# EAGLE design Arduino_DUE_X_V02d-2Layer (EAGLE 7.1.0)
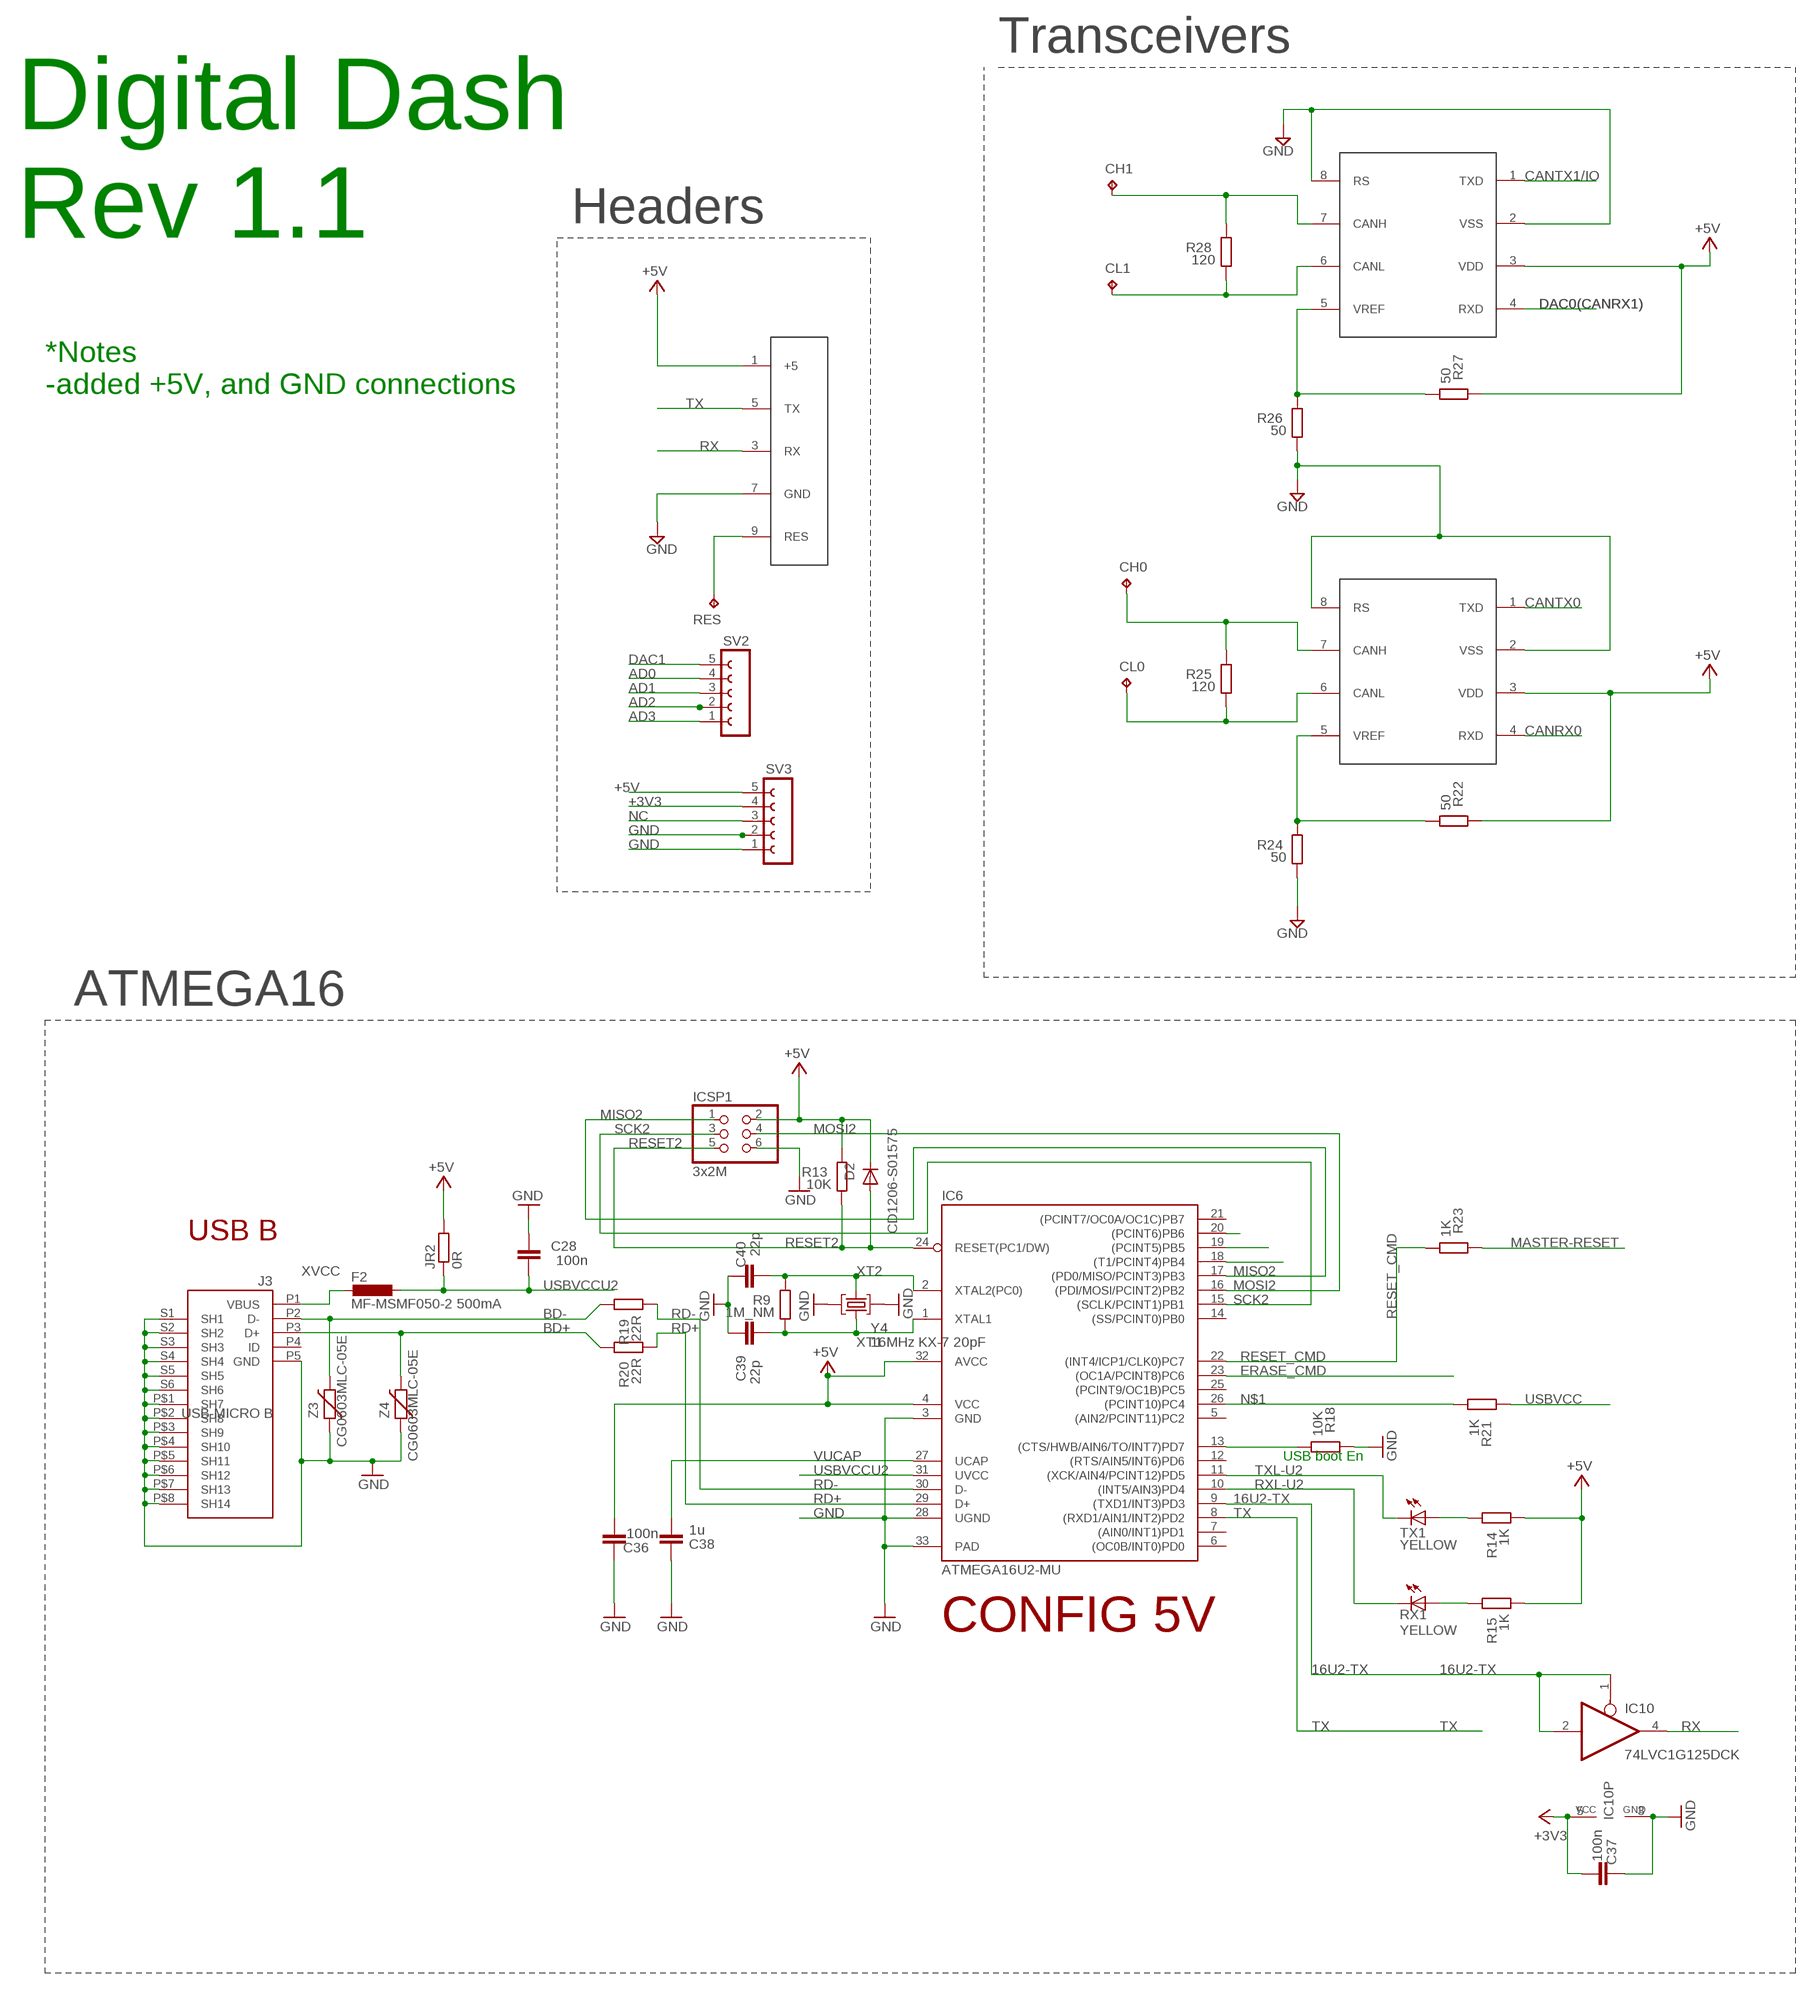
[diagram p0: schematic, sheet 1, part 1 of 2]
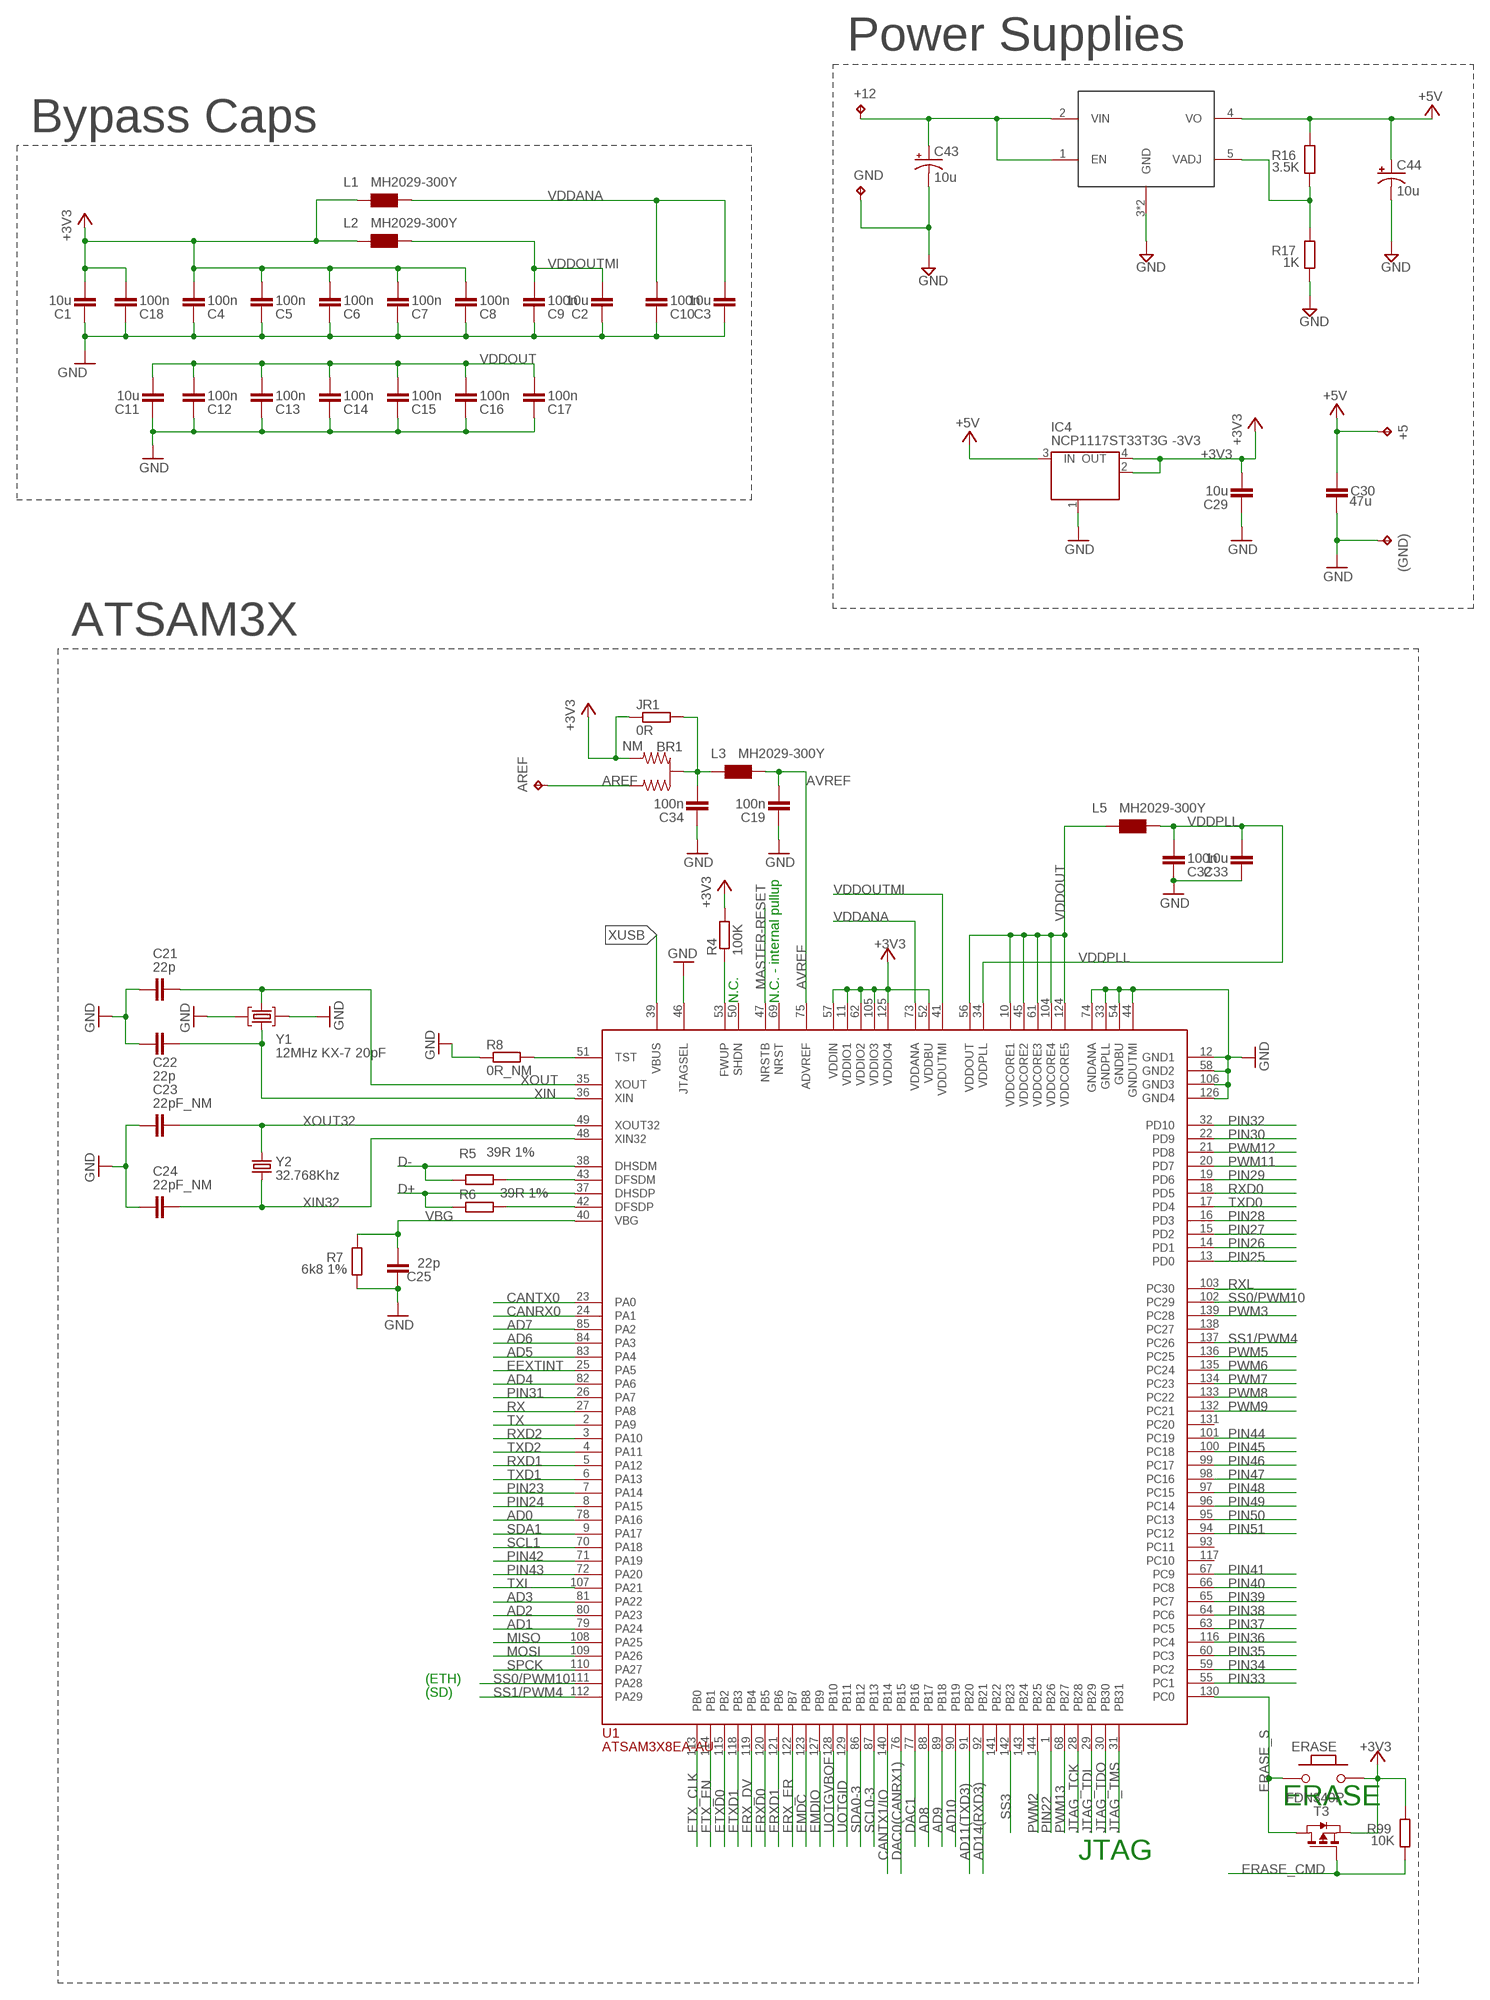
[diagram p1: schematic, sheet 1, part 2 of 2]

## Parts
(GND)  TPPAD1-13  [P1-13]
+5  TPPAD1-13  [P1-13]
+12  TPPAD1-13  [P1-13]
AREF  TPB1,27  [B1,27]
BR1  NM  J0402  [J0402]
C1  10u  C-EUC0805K  [C0805K]
C2  10u  C-EUC0805K  [C0805K]
C3  10u  C-EUC0805K  [C0805K]
C4  100n  C-EUC0805  [C0805]
C5  100n  C-EUC0805  [C0805]
C6  100n  C-EUC0805  [C0805]
C7  100n  C-EUC0805  [C0805]
C8  100n  C-EUC0805  [C0805]
C9  100n  C-EUC0805  [C0805]
C10  100n  C-EUC0805  [C0805]
C11  10u  C-EUC0805K  [C0805K]
C12  100n  C-EUC0805  [C0805]
C13  100n  C-EUC0805  [C0805]
C14  100n  C-EUC0805  [C0805]
C15  100n  C-EUC0805  [C0805]
C16  100n  C-EUC0805  [C0805]
C17  100n  C-EUC0805  [C0805]
C18  100n  C-EUC0805  [C0805]
C19  100n  C-EUC0805  [C0805]
C21  22p  C-EUC0805  [C0805]
C22  22p  C-EUC0805  [C0805]
C23  22pF_NM  C-EUC0805  [C0805]
C24  22pF_NM  C-EUC0805  [C0805]
C25  22p  C-EUC0805  [C0805]
C28  100n  C-EUC0805  [C0805]
C29  10u  C-EUC0805K  [C0805K]
C30  47u  C-EUC0805  [C0805]
C32  100n  C-EUC0805  [C0805]
C33  10u  C-EUC0805K  [C0805K]
C34  100n  C-EUC0805  [C0805]
C36  100n  C-EUC0805  [C0805]
C37  100n  C-EUC0805  [C0805]
C38  1u  C-EUC0805  [C0805]
C39  22p  C-EUC0805  [C0805]
C40  22p  C-EUC0805  [C0805]
C43  10u  CPOL-US153CLV-0405  [153CLV-0405]
C44  10u  CPOL-US153CLV-0405  [153CLV-0405]
CH0  TPPAD1-13  [P1-13]
CH1  TPPAD1-13  [P1-13]
CL0  TPPAD1-13  [P1-13]
CL1  TPPAD1-13  [P1-13]
D2  CD1206-S01575  DIODE-MINIMELF  [MINIMELF]
ERASE  MYSMD_PB157  [SMD_157SW]
F2  MF-MSMF050-2 500mA  L-EUL1812  [L1812]
GND  TPPAD1-13  [P1-13]
IC4  NCP1117ST33T3G -3V3  MC33269ST-3.3T3  [SOT223]
IC6  ATMEGA16U2-MU  [MLF32]
IC10  74LVC1G125DCK  [SC70-5]
ICSP1  3x2M  PINHD-2X3  [2X03]
J3  USB-MICRO B  MYCON2_USB-MINI-B  [CON2_USB_MICRO_B_AT]
JR1  0R  R-EU_R0805  [R0805]
JR2  0R  R-EU_R0805  [R0805]
L1  MH2029-300Y  WE-CBF_0805  [0805]
L2  MH2029-300Y  WE-CBF_0805  [0805]
L3  MH2029-300Y  WE-CBF_0805  [0805]
L5  MH2029-300Y  WE-CBF_0805  [0805]
R4  100K  R-EU_R0805  [R0805]
R5  39R 1%  R-EU_R0805  [R0805]
R6  39R 1%  R-EU_R0805  [R0805]
R7  6k8 1%  R-EU_R0805  [R0805]
R8  0R_NM  R-EU_R0805  [R0805]
R9  1M_NM  R-EU_R0805  [R0805]
R13  10K  R-EU_R0805  [R0805]
R14  1K  R-EU_R0805  [R0805]
R15  1K  R-EU_R0805  [R0805]
R16  3.5K  R-EU_R0805  [R0805]
R17  1K  R-EU_R0805  [R0805]
R18  10K  R-EU_R0805  [R0805]
R19  22R  R-EU_R0805  [R0805]
R20  22R  R-EU_R0805  [R0805]
R21  1K  R-EU_R0805  [R0805]
R22  50  R-EU_R0805  [R0805]
R23  1K  R-EU_R0805  [R0805]
R24  50  R-EU_R0805  [R0805]
R25  120  R-EU_R0805  [R0805]
R26  50  R-EU_R0805  [R0805]
R27  50  R-EU_R0805  [R0805]
R28  120  R-EU_R0805  [R0805]
R99  10K  R-EU_R0805  [R0805]
RES  TPB1,27  [B1,27]
RX1  YELLOW  LEDCHIP-LED0805  [CHIP-LED0805]
SV2  FE05-1  [FE05-1]
SV3  FE05-1  [FE05-1]
T3  FDN340P  PMOSSOT23  [SOT-23]
TX1  YELLOW  LEDCHIP-LED0805  [CHIP-LED0805]
U1  ATSAM3X8EA-AU  ATSAM3X/AAU  [LQFP144]
U2  MCP2551  [SOIC8]
U3  LCD_DISPLAY  [FE05-2]
U4  MCP2551  [SOIC8]
U5  TLF1963TBATMA1  TLF1963  [DPAK]
Y1  12MHz KX-7 20pF  CRYSTAL-3.2-2.5  [CRYSTAL-3.2-2.5]
Y2  32.768Khz  RESONATOR_EPSON_FC_145  [RESONATOR_EPSON_FC_145]
Y4  16MHz KX-7 20pF  CRYSTAL-3.2-2.5  [CRYSTAL-3.2-2.5]
Z3  CG0603MLC-05E  VARISTORCN0603  [CT/CN0603]
Z4  CG0603MLC-05E  VARISTORCN0603  [CT/CN0603]

## Nets
8PB4: IC6.18((T1/PCINT4)PB4)
8PB5: IC6.19((PCINT5)PB5)
8PB6: IC6.20((PCINT6)PB6)
16U2-TX: IC6.9((TXD1/INT3)PD3) IC10.1(OE) IC10.2(I)
+3V3: BR1.3 C1.2 C4.2 C5.2 C6.2 C7.2 C8.2 C18.2 C29.2 C37.1 ERASE.1 IC4.2(OUT) IC4.4(OUT) IC10.5(VCC) JR1.1 L1.1 L2.1 R4.2 R99.2 SV3.4 T3.1(S) U1.11(VDDIO1) U1.52(VDDBU) U1.57(VDDIN) U1.62(VDDIO2) U1.105(VDDIO3) U1.125(VDDIO4)
+5V: +5.TP C30.2 C36.1 C44.+ D2.C IC4.3(IN) IC6.4(VCC) IC6.32(AVCC) ICSP1.2 JR2.2 R13.2 R14.1 R15.1 R16.2 R22.2 R27.2 SV3.5 U2.3(VDD) U3.1(+5) U4.3(VDD) U5.4(VO)
AD0: SV2.4 U1.78(PA16)
AD1: SV2.3 U1.79(PA24)
AD2: SV2.2 U1.80(PA23)
AD3: SV2.1 U1.81(PA22)
AD4: U1.82(PA6)
AD5: U1.83(PA4)
AD6: U1.84(PA3)
AD7: U1.85(PA2)
AD8: U1.88(PB17)
AD9: U1.89(PB18)
AD10: U1.90(PB19)
AD11(TXD3): U1.91(PB20)
AD14(RXD3): U1.92(PB21)
AREF: AREF.TP BR1.1
AVREF: C19.2 L3.2 U1.75(ADVREF)
AVREFL: BR1.2(C) C34.2 JR1.2 L3.1
BD+ [USB]: J3.P3(D+) R20.2 Z4.2
BD- [USB]: J3.P2(D-) R19.2 Z3.2
CANRX0: U1.24(PA1) U4.4(RXD)
CANTX0: U1.23(PA0) U4.1(TXD)
CANTX1/IO: U1.140(PB14) U2.1(TXD)
D+ [USBpair]: R6.1 U1.37(DHSDP)
D- [USBpair]: R5.1 U1.38(DHSDM)
DAC0(CANRX1): U1.76(PB15) U2.4(RXD)
DAC1: SV2.5 U1.77(PB16)
DTR: IC6.13((CTS/HWB/AIN6/TO/INT7)PD7) R18.1
EEXTINT: U1.25(PA5)
EMDC: U1.123(PB8)
EMDIO: U1.127(PB9)
ERASE_CMD: IC6.23((OC1A/PCINT8)PC6) R99.1 T3.2(G)
ERASE_S: ERASE.2 T3.3(D) U1.130(PC0)
ERX_DV: U1.119(PB4)
ERX_ER: U1.122(PB7)
ERXD0: U1.120(PB5)
ERXD1: U1.121(PB6)
ETX_CLK: U1.113(PB0)
ETX_EN: U1.114(PB1)
ETXD0: U1.115(PB2)
ETXD1: U1.118(PB3)
GND: (GND).TP C1.1 C2.1 C3.1 C4.1 C5.1 C6.1 C7.1 C8.1 C9.1 C10.1 C11.1 C12.1 C13.1 C14.1 C15.1 C16.1 C17.1 C18.1 C19.1 C21.2 C22.2 C23.2 C24.2 C25.2 C28.2 C29.1 C30.1 C32.1 C33.1 C34.1 C36.2 C37.2 C38.2 C39.2 C40.2 C43.- C44.- GND.TP IC4.1(GND/ADJ) IC6.3(GND) IC6.28(UGND) IC6.33(PAD) IC10.3(GND) ICSP1.6 J3.P5(GND) J3.P$1(SH7) J3.P$2(SH8) J3.P$3(SH9) J3.P$4(SH10) J3.P$5(SH11) J3.P$6(SH12) J3.P$7(SH13) J3.P$8(SH14) J3.S1(SH1) J3.S2(SH2) J3.S3(SH3) J3.S4(SH4) J3.S5(SH5) J3.S6(SH6) R7.1 R8.1 R17.1 R18.2 R24.1 R26.1 SV3.1 SV3.2 U1.12(GND1) U1.33(GNDPLL) U1.44(GNDUTMI) U1.46(JTAGSEL) U1.54(GNDBU) U1.58(GND2) U1.74(GNDANA) U1.106(GND3) U1.126(GND4) U2.2(VSS) U2.8(RS) U3.7(GND) U4.2(VSS) U4.8(RS) U5.3(GND) U5.6(GND) Y1.2(GND) Y1.4(GND) Y4.2(GND) Y4.4(GND) Z3.1 Z4.1
JTAG_TCK: U1.28(PB28)
JTAG_TDI: U1.29(PB29)
JTAG_TDO: U1.30(PB30)
JTAG_TMS: U1.31(PB31)
MASTER-RESET: R23.2 RES.TP U1.47(NRSTB) U3.9(RES)
MISO: U1.108(PA25)
MISO2: IC6.17((PD0/MISO/PCINT3)PB3) ICSP1.1
MOSI: U1.109(PA26)
MOSI2: IC6.16((PDI/MOSI/PCINT2)PB2) ICSP1.4
N$1: IC6.26((PCINT10)PC4) R21.1
N$4: R15.2 RX1.A
N$5: R8.2 U1.51(TST)
N$7: R4.1 U1.53(FWUP)
N$11: R5.2 U1.43(DFSDM)
N$12: R6.2 U1.42(DFSDP)
N$13: +12.TP C43.+ U5.1(EN) U5.2(VIN)
N$14: R14.2 TX1.A
N$15: R16.1 R17.2 U5.5(VADJ)
N$16: R26.2 R27.1 U2.5(VREF)
N$17: R22.1 R24.2 U4.5(VREF)
N$18: CH0.TP R25.2 U4.7(CANH)
N$19: CL0.TP R25.1 U4.6(CANL)
N$21: CH1.TP R28.2 U2.7(CANH)
N$22: CL1.TP R28.1 U2.6(CANL)
NC: SV3.3
PIN22: U1.1(PB26)
PIN23: U1.7(PA14)
PIN24: U1.8(PA15)
PIN25: U1.13(PD0)
PIN26: U1.14(PD1)
PIN27: U1.15(PD2)
PIN28: U1.16(PD3)
PIN29: U1.19(PD6)
PIN30: U1.22(PD9)
PIN31: U1.26(PA7)
PIN32: U1.32(PD10)
PIN33: U1.55(PC1)
PIN34: U1.59(PC2)
PIN35: U1.60(PC3)
PIN36: U1.116(PC4)
PIN37: U1.63(PC5)
PIN38: U1.64(PC6)
PIN39: U1.65(PC7)
PIN40: U1.66(PC8)
PIN41: U1.67(PC9)
PIN42: U1.71(PA19)
PIN43: U1.72(PA20)
PIN44: U1.101(PC19)
PIN45: U1.100(PC18)
PIN46: U1.99(PC17)
PIN47: U1.98(PC16)
PIN48: U1.97(PC15)
PIN49: U1.96(PC14)
PIN50: U1.95(PC13)
PIN51: U1.94(PC12)
PWM2: U1.144(PB25)
PWM3: U1.139(PC28)
PWM5: U1.136(PC25)
PWM6: U1.135(PC24)
PWM7: U1.134(PC23)
PWM8: U1.133(PC22)
PWM9: U1.132(PC21)
PWM11: U1.20(PD7)
PWM12: U1.21(PD8)
PWM13: U1.68(PB27)
RD+: IC6.29(D+) R20.1
RD-: IC6.30(D-) R19.1
RESET2: D2.A IC6.24(RESET(PC1/DW)) ICSP1.5 R13.1
RESET_CMD: IC6.22((INT4/ICP1/CLK0)PC7) R23.1
RX: IC10.4(O) U1.27(PA8) U3.3(RX)
RXD0: U1.18(PD5)
RXD1: U1.5(PA12)
RXD2: U1.3(PA10)
RXL: U1.103(PC30)
RXL-U2: IC6.10((INT5/AIN3)PD4) RX1.C
SCK2: IC6.15((SCLK/PCINT1)PB1) ICSP1.3
SCL0-3: U1.87(PB13)
SCL1: U1.70(PA18)
SDA0-3: U1.86(PB12)
SDA1: U1.9(PA17)
SPCK: U1.110(PA27)
SS0/PWM10: U1.102(PC29) U1.111(PA28)
SS1/PWM4: U1.112(PA29) U1.137(PC26)
SS3: U1.142(PB23)
TX: IC6.8((RXD1/AIN1/INT2)PD2) U1.2(PA9) U3.5(TX)
TXD0: U1.17(PD4)
TXD1: U1.6(PA13)
TXD2: U1.4(PA11)
TXL: U1.107(PA21)
TXL-U2: IC6.11((XCK/AIN4/PCINT12)PD5) TX1.C
UOTGID: U1.129(PB11)
UOTGVBOF: U1.128(PB10)
USBVCC: R21.2
USBVCCU2: C28.1 F2.1 IC6.31(UVCC) JR2.1
VBG: C25.1 R7.2 U1.40(VBG)
VDDANA: C3.2 C10.2 L1.2 U1.73(VDDANA)
VDDOUT: C11.2 C12.2 C13.2 C14.2 C15.2 C16.2 C17.2 L5.1 U1.10(VDDCORE1) U1.45(VDDCORE2) U1.56(VDDOUT) U1.61(VDDCORE3) U1.104(VDDCORE4) U1.124(VDDCORE5)
VDDOUTMI: C2.2 C9.2 L2.2 U1.41(VDDUTMI)
VDDPLL: C32.2 C33.2 L5.2 U1.34(VDDPLL)
VUCAP: C38.1 IC6.27(UCAP)
XIN: C22.1 U1.36(XIN) Y1.1(C1)
XIN32: C24.1 U1.48(XIN32) Y2.P$2
XOUT: C21.1 U1.35(XOUT) Y1.3(C2)
XOUT32: C23.1 U1.49(XOUT32) Y2.P$1
XT1: C39.1 IC6.1(XTAL1) R9.1 Y4.1(C1)
XT2: C40.1 IC6.2(XTAL2(PC0)) R9.2 Y4.3(C2)
XUSB [usbvcc]: U1.39(VBUS)
XVCC [usbvcc]: F2.2 J3.P1(VBUS)
Unconnected: IC6.5((AIN2/PCINT11)PC2) IC6.6((OC0B/INT0)PD0) IC6.7((AIN0/INT1)PD1) IC6.12((RTS/AIN5/INT6)PD6) IC6.14((SS/PCINT0)PB0) IC6.21((PCINT7/OC0A/OC1C)PB7) IC6.25((PCINT9/OC1B)PC5) J3.P4(ID) U1.50(SHDN) U1.69(NRST) U1.93(PC11) U1.117(PC10) U1.131(PC20) U1.138(PC27) U1.141(PB22) U1.143(PB24)

## Notes on the sheet
- Power Supplies
- Transceivers | Bypass Caps
- Headers
- Digital Dash
  Rev 1.1
- *Notes
  -added +5V, and GND connections
- ATSAM3X
- N.C. | N.C. - internal pullup
- ATMEGA16
- USB B
- USB boot En
- CONFIG 5V
- (ETH)
- (SD)
- ERASE
- JTAG

## Library data of the parts
(GND) +5 +12 AREF CH0 CH1 CL0 CL1 GND RES = testpad:TP: Test pad
BR1 = bibaja:J: Three terminal jumper made from two 0402, 0603, 0805, etc.
C1-C19 C21-C25 C28-C30 C32-C34 C36-C40 = SmartPrj:C-EU: CAPACITOR, European symbol
C43 C44 = Dash parts:CPOL-US: POLARIZED CAPACITOR, American symbol; EEE-FPV100UAR: 10u
D2 = diode:DIODE-: DIODE
ERASE = SmartPrj:MYSMD_PB157
F2 = rcl:L-EU: INDUCTOR, European symbol
IC4 = linear:MC33269ST*: Adjustable Output Low Dropout Voltage Regulator 800 mA Source: http://www.onsemi.com/pub/Collateral/MC33269-D.PDF
IC6 = SmartPrj:ATMEGA16U2-
IC10 = 74xx-little-us:74*1G125: Single Bus Buffer Gate with 3-State Output
ICSP1 = SmartPrj:PINHD-2X3: PIN HEADER
J3 = SmartPrj:MYCON2_USB-MINI-B
JR1 JR2 R4-R9 R13-R15 R18-R28 R99 = SmartPrj:R-EU_: RESISTOR, European symbol
L1-L3 L5 = wuerth-elektronik:WE-CBF: SMD EMI Suppression Ferrite Beads - excellent anti-EMI properties - low DCR - impedances till 3000 ohms - rated current up to 6 A
R16 = SmartPrj:R-EU_: RESISTOR, European symbol; SMD: 3.5K, 1%
R17 = SmartPrj:R-EU_: RESISTOR, European symbol; SMD: 1K, 1%
RX1 TX1 = led:LED: LED OSRAM: - CHIPLED LG R971, LG N971, LY N971, LG Q971, LY Q971, LO R971, LY R971 LH N974, LH R974 LS Q976, LO Q976, LY Q976 LO Q996 - Hyper CHIPLED LW Q18S LB Q993, LB Q99A, LB R99A - SideLED LS A670, LO A670, LY A670, LG A670, LP A670 LB A673, LV A673, LT A673, LW A673 LH A674 LY A675 LS A676, LA A676, LO A676, LY A676, LW A676 LS A679, LY A679, LG A679 - Hyper Micro SIDELED® LS Y876, LA Y876, LO Y876, LY Y876 LT Y87S - SmartLED LW L88C, LW L88S LB L89C, LB L89S, LG L890 LS L89K, LO L89K, LY L89K LS L896, LA L896, LO L896, LY L896 - TOPLED LS T670, LO T670, LY T670, LG T670, LP T670 LSG T670, LSP T670, LSY T670, LOP T670, LYG T670 LG T671, LOG T671, LSG T671 LB T673, LV T673, LT T673, LW T673 LH T674 LS T676, LA T676, LO T676, LY T676, LB T676, LH T676, LSB T676, LW T676 LB T67C, LV T67C, LT T67C, LS T67K, LO T67K, LY T67K, LW E67C LS E67B, LA E67B, LO E67B, LY E67B, LB E67C, LV E67C, LT E67C LW T67C LS T679, LY T679, LG T679 LS T770, LO T770, LY T770, LG T770, LP T770 LB T773, LV T773, LT T773, LW T773 LH T774 LS E675, LA E675, LY E675, LS T675 LS T776, LA T776, LO T776, LY T776, LB T776 LHGB T686 LT T68C, LB T68C - Hyper Mini TOPLED® LB M676 - Mini TOPLED Santana® LG M470 LS M47K, LO M47K, LY M47K Source: http://www.osram.convergy.de LUXEON: - LUMILED® LXK2-PW12-R00, LXK2-PW12-S00, LXK2-PW14-U00, LXK2-PW14-V00 LXK2-PM12-R00, LXK2-PM12-S00, LXK2-PM14-U00 LXK2-PE12-Q00, LXK2-PE12-R00, LXK2-PE12-S00, LXK2-PE14-T00, LXK2-PE14-U00 LXK2-PB12-K00, LXK2-PB12-L00, LXK2-PB12-M00, LXK2-PB14-N00, LXK2-PB14-P00, LXK2-PB14-Q00 LXK2-PR12-L00, LXK2-PR12-M00, LXK2-PR14-Q00, LXK2-PR14-R00 LXK2-PD12-Q00, LXK2-PD12-R00, LXK2-PD12-S00 LXK2-PH12-R00, LXK2-PH12-S00 LXK2-PL12-P00, LXK2-PL12-Q00, LXK2-PL12-R00 Source: www.luxeon.com KINGBRIGHT: KA-3528ASYC Source: www.kingbright.com
SV2 SV3 = con-lsta:FE05-1: FEMALE HEADER; OC_FARNELL: unknown; OC_NEWARK: unknown
T3 = zetex:PMOSSOT23: MOS FET; OC_FARNELL: unknown; OC_NEWARK: unknown
U1 = SmartPrj:ATSAM3X/A
U2 U4 = Dash parts:MCP2551
U3 = Dash parts:LCD_DISPLAY
U5 = Dash parts:TLF1963
Y1 Y4 = SmartPrj:CRYSTAL-3.2-2.5
Y2 = Arduino_Wifi_shield_v018_tG:RESONATOR_EPSON_FC_145
Z3 Z4 = varistor:VARISTOR: VARISTOR

## Net classes
0 default: width 0.203 mm, drill 0.406 mm, clearance 0.203 mm
1 USB: width 0.203 mm, drill 0.406 mm, clearance 0.203 mm
2 gnd: width 0.203 mm, drill 0.406 mm, clearance 0.203 mm
3 usbvcc: width 0.203 mm, drill 0.406 mm, clearance 0.203 mm
4 USBpair: width 0.254 mm, drill 0.406 mm, clearance 0.61 mm

## Board
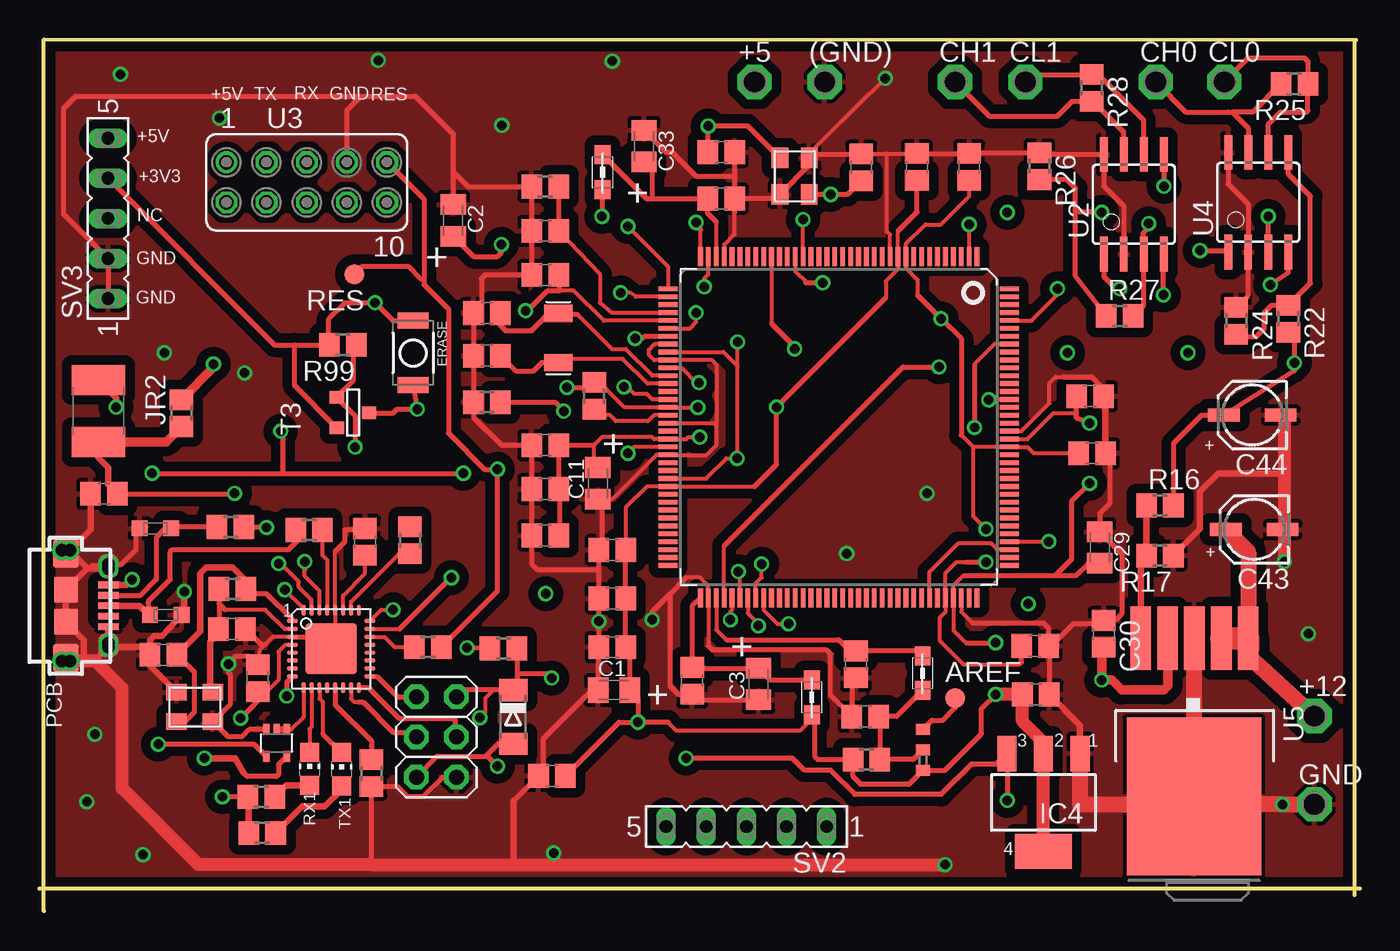
[diagram p2: board, top side]
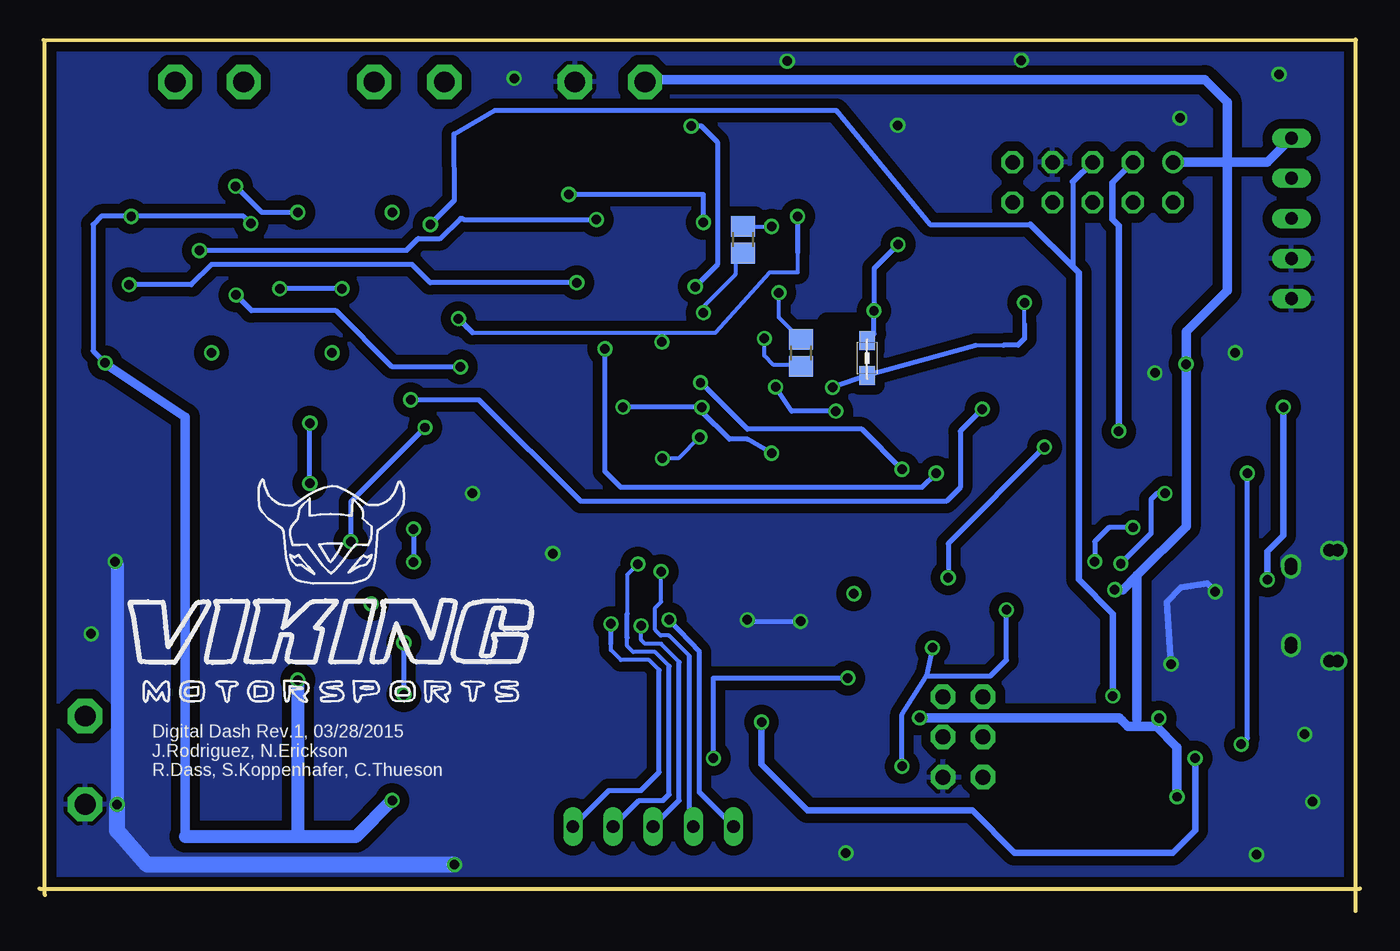
[diagram p3: board, bottom side, seen from below]

Size 83.54 x 55.15 mm. Coordinates in mm from the lower left corner, seen from the top.
Outline: 0.27,0 0.27,55.15
Outline: 83.29,55.11 0.25,55.13
Outline: 83.54,1.41 0,1.41
Outline: 83.2,1.02 83.2,55.02
Copper layers (1*16): Top 0.0356mm / dielectric 1.5011mm / Bottom 0.0356mm
Design rules "LaenPCBOrder": minimum track width 6mil, minimum drill 13mil, track to track 6mil, track to pad 6mil, pad to pad 6mil, via to via 6mil, smd to smd 6mil, copper to edge 15mil, drill to drill 6mil, minimum pad ring 7mil, minimum via ring 7mil, stop-mask expansion 3mil, vias tented up to drill 0mil, thermal gap 10mil

### Footprints (pad centres in the part's own frame; a part is rotated, then mirrored left to right if it is on the bottom)
P1-13 = drill 1.321 pad 2.159 octagon: TP 0,0
B1,27 = smd 1.27 x 1.27: TP 0,0
J0402 = smd 0.7 x 0.9: 1 -0.65,0; 2 0.65,0; 3 1.95,0
C0805K = smd 1.3 x 1.6: 1 -1,0; 2 1,0
C0805 = smd 1.3 x 1.5: 1 -0.85,0; 2 0.85,0
153CLV-0405 = smd 2 x 0.8: + 1.8,0; - -1.8,0
MINIMELF = smd 1.4 x 1.8: A 1.7,0; C -1.7,0
SMD_157SW = smd 1.016 x 1.981: 1 -2.032,0; 2 2.032,0
L1812 = smd 1.9 x 3.4: 1 -1.95,0; 2 1.95,0
SOT223 = smd 1.219 x 2.235: 1 -2.311,-3.099; 2 0,-3.099; 3 2.311,-3.099 | smd 3.6 x 2.2: 4 0,3.099
MLF32 = smd 0.7 x 0.28: 1 -2.45,1.75; 2 -2.45,1.25; 3 -2.45,0.75; 4 -2.45,0.25; 5 -2.45,-0.25; 6 -2.45,-0.75; 7 -2.45,-1.25; 8 -2.45,-1.75; 17 2.45,-1.75; 18 2.45,-1.25; 19 2.45,-0.75; 20 2.45,-0.25; 21 2.45,0.25; 22 2.45,0.75; 23 2.45,1.25; 24 2.45,1.75 | smd 0.28 x 0.7: 9 -1.75,-2.45; 10 -1.25,-2.45; 11 -0.75,-2.45; 12 -0.25,-2.45; 13 0.25,-2.45; 14 0.75,-2.45; 15 1.25,-2.45; 16 1.75,-2.45; 25 1.75,2.45; 26 1.25,2.45; 27 0.75,2.45; 28 0.25,2.45; 29 -0.25,2.45; 30 -0.75,2.45; 31 -1.25,2.45; 32 -1.75,2.45 | smd 3.254 x 3.254: 33 0,0
SC70-5 = smd 0.4 x 0.7: 1 -0.65,-0.85; 2 0,-0.85; 3 0.65,-0.85; 4 0.65,0.85; 5 -0.65,0.85
2X03 = drill 0.95 pad 1.55 octagon: 1 -2.54,-1.27; 2 -2.54,1.27; 3 0,-1.27; 4 0,1.27; 5 2.54,-1.27; 6 2.54,1.27
CON2_USB_MICRO_B_AT = smd 0.406 x 1.346: P1 -1.321,2.692; P2 -0.66,2.692; P3 0,2.692; P4 0.66,2.692; P5 1.321,2.692 | drill 0.8 pad 1.27: P$1 -2.616,2.692 | drill 0.8 pad 1.245: P$2 -2.362,2.692; P$7 2.362,2.692; P$8 2.616,2.692 | drill 0.8 pad 1.143: P$3 -3.505,-0.254; P$4 -3.505,0.254; P$5 3.505,0.254; P$6 3.505,-0.254 | smd 1.778 x 1.651: S1 -3.302,0; S2 3.302,0 | smd 1.524 x 1.27: S3 -2.489,2.692; S4 2.489,2.692 | smd 1.626 x 1.524: S5 -1.016,0; S6 1.016,0
R0805 = smd 1.3 x 1.5: 1 -0.85,0; 2 0.85,0
0805 = smd 1.2 x 1: 1 -1.1,0; 2 1.1,0
CHIP-LED0805 = smd 1.2 x 1.2: A 0,-1.05; C 0,1.05
FE05-1 = drill 0.813 long: 1 -5.08,0; 2 -2.54,0; 3 0,0; 4 2.54,0; 5 5.08,0
SOT-23 = smd 0.787 x 0.889: 1 -0.94,1.016; 2 0.991,1.016; 3 0.025,-1.016
LQFP144 = smd 0.3 x 1.2: 1 -8.75,-10.8; 2 -8.25,-10.8; 3 -7.75,-10.8; 4 -7.25,-10.8; 5 -6.75,-10.8; 6 -6.25,-10.8; 7 -5.75,-10.8; 8 -5.25,-10.8; 9 -4.75,-10.8; 10 -4.25,-10.8; 11 -3.75,-10.8; 12 -3.25,-10.8; 13 -2.75,-10.8; 14 -2.25,-10.8; 15 -1.75,-10.8; 16 -1.25,-10.8; 17 -0.75,-10.8; 18 -0.25,-10.8; 19 0.25,-10.8; 20 0.75,-10.8; 21 1.25,-10.8; 22 1.75,-10.8; 23 2.25,-10.8; 24 2.75,-10.8; 25 3.25,-10.8; 26 3.75,-10.8; 27 4.25,-10.8; 28 4.75,-10.8; 29 5.25,-10.8; 30 5.75,-10.8; 31 6.25,-10.8; 32 6.75,-10.8; 33 7.25,-10.8; 34 7.75,-10.8; 35 8.25,-10.8; 36 8.75,-10.8; 73 8.75,10.8; 74 8.25,10.8; 75 7.75,10.8; 76 7.25,10.8; 77 6.75,10.8; 78 6.25,10.8; 79 5.75,10.8; 80 5.25,10.8; 81 4.75,10.8; 82 4.25,10.8; 83 3.75,10.8; 84 3.25,10.8; 85 2.75,10.8; 86 2.25,10.8; 87 1.75,10.8; 88 1.25,10.8; 89 0.75,10.8; 90 0.25,10.8; 91 -0.25,10.8; 92 -0.75,10.8; 93 -1.25,10.8; 94 -1.75,10.8; 95 -2.25,10.8; 96 -2.75,10.8; 97 -3.25,10.8; 98 -3.75,10.8; 99 -4.25,10.8; 100 -4.75,10.8; 101 -5.25,10.8; 102 -5.75,10.8; 103 -6.25,10.8; 104 -6.75,10.8; 105 -7.25,10.8; 106 -7.75,10.8; 107 -8.25,10.8; 108 -8.75,10.8 | smd 1.2 x 0.3: 37 10.8,-8.75; 38 10.8,-8.25; 39 10.8,-7.75; 40 10.8,-7.25; 41 10.8,-6.75; 42 10.8,-6.25; 43 10.8,-5.75; 44 10.8,-5.25; 45 10.8,-4.75; 46 10.8,-4.25; 47 10.8,-3.75; 48 10.8,-3.25; 49 10.8,-2.75; 50 10.8,-2.25; 51 10.8,-1.75; 52 10.8,-1.25; 53 10.8,-0.75; 54 10.8,-0.25; 55 10.8,0.25; 56 10.8,0.75; 57 10.8,1.25; 58 10.8,1.75; 59 10.8,2.25; 60 10.8,2.75; 61 10.8,3.25; 62 10.8,3.75; 63 10.8,4.25; 64 10.8,4.75; 65 10.8,5.25; 66 10.8,5.75; 67 10.8,6.25; 68 10.8,6.75; 69 10.8,7.25; 70 10.8,7.75; 71 10.8,8.25; 72 10.8,8.75; 109 -10.8,8.75; 110 -10.8,8.25; 111 -10.8,7.75; 112 -10.8,7.25; 113 -10.8,6.75; 114 -10.8,6.25; 115 -10.8,5.75; 116 -10.8,5.25; 117 -10.8,4.75; 118 -10.8,4.25; 119 -10.8,3.75; 120 -10.8,3.25; 121 -10.8,2.75; 122 -10.8,2.25; 123 -10.8,1.75; 124 -10.8,1.25; 125 -10.8,0.75; 126 -10.8,0.25; 127 -10.8,-0.25; 128 -10.8,-0.75; 129 -10.8,-1.25; 130 -10.8,-1.75; 131 -10.8,-2.25; 132 -10.8,-2.75; 133 -10.8,-3.25; 134 -10.8,-3.75; 135 -10.8,-4.25; 136 -10.8,-4.75; 137 -10.8,-5.25; 138 -10.8,-5.75; 139 -10.8,-6.25; 140 -10.8,-6.75; 141 -10.8,-7.25; 142 -10.8,-7.75; 143 -10.8,-8.25; 144 -10.8,-8.75
SOIC8 = smd 0.5 x 2.2: 1 -1.905,-3.154; 2 -0.645,-3.154; 3 0.625,-3.154; 4 1.895,-3.154; 5 1.905,3.154; 6 0.635,3.154; 7 -0.635,3.154; 8 -1.905,3.154
FE05-2 = drill 0.914: 1 -5.08,1.27 | drill 0.914 octagon: 2 -5.08,-1.27; 3 -2.54,1.27; 4 -2.54,-1.27; 5 0,1.27; 6 0,-1.27; 7 2.54,1.27; 8 2.54,-1.27; 9 5.08,1.27; 10 5.08,-1.27
DPAK = smd 1.31 x 4: 1 -2.28,-4.04; 2 -0.58,-4.04; 3 1.12,-4.04; 4 2.82,-4.04; 5 4.52,-4.04 | smd 8.5 x 10: 6 1.15,5.97
CRYSTAL-3.2-2.5 = smd 1.3 x 1.05: 1 -1.15,-0.925; 2 1.15,-0.925; 3 1.15,0.925; 4 -1.15,0.925
RESONATOR_EPSON_FC_145 = smd 1.1 x 1.8: P$1 -1.55,0; P$2 1.55,0
CT/CN0603 = smd 1 x 1: 1 -1,0; 2 1,0

### Placement (x,y rotation side)
(GND)  49.67,52.47 0 top
+5  45.23,52.47 0 top
+12  80.66,12.34 0 top
AREF  57.93,13.48 0 top
BR1  55.9,10.86 270 top
C1  36.34,13.99 0 top
C2  26.18,43.7 270 top
C3  45.48,14.37 90 top
C4  36.24,19.78 0 top
C5  55.52,47.08 270 top
C6  36.24,22.85 0 top
C7  63.03,13.71 180 top
C8  66.46,32.58 180 top
C9  31.99,40.25 0 top
C10  41.29,14.57 90 top
C11  35.32,27.07 90 top
C12  31.99,26.71 0 top
C13  58.82,47.08 270 top
C14  31.99,29.48 0 top
C15  31.99,23.77 0 top
C16  62.98,16.78 180 top
C17  66.59,28.97 180 top
C18  36.24,16.7 0 top
C19  51.65,15.61 90 top
C21  43.12,48.02 0 top
C22  51.98,47.06 90 top
C23  28.31,35.14 180 top
C24  28.31,37.84 180 top
C25  31.99,43.04 180 top
C28  4.08,26.41 180 top
C29  67.07,23 270 top
C30  67.33,17.54 270 top
C32  43.12,45.08 180 top
C33  38.24,48.4 270 top
C34  52.24,12.31 0 top
C36  13.81,14.75 90 top
C37  32.42,8.56 180 top
C38  20.59,23.36 90 top
C39  7.84,16.22 180 top
C40  12.18,17.85 0 top
C43  76.85,24.15 180 top
C44  76.72,31.39 180 top
CH0  70.63,52.47 0 top
CH1  57.93,52.47 0 top
CL0  74.95,52.47 0 top
CL1  62.37,52.47 0 top
D2  29.96,12.28 270 top
ERASE  23.64,35.32 270 top
F2  3.72,31.64 90 top
GND  80.66,6.75 0 top
IC4  63.52,6.87 180 top
IC6  18.46,16.6 0 top
IC10  15,10.64 180 top
ICSP1  25.11,11.01 270 top
J3  1.67,19.32 270 top
JR1  52.31,9.59 0 top
JR2  8.98,31.51 90 top
L1  48.86,13.53 90 top
L2  31.18,34.99 90 bottom
L3  55.87,15.05 90 top
L5  35.63,46.75 90 top
R4  35.09,32.6 90 top
R5  35.37,35.32 270 bottom
R6  39.03,42.48 270 bottom
R7  31.99,45.84 0 top
R8  28.31,32.2 0 top
R9  12.21,20.39 180 top
R13  29.35,16.63 0 top
R14  14.09,4.94 0 top
R15  14.04,7.23 0 top
R16  70.88,25.67 0 top
R17  70.88,22.5 180 top
R18  21,8.73 270 top
R19  12.08,24.3 180 top
R20  17.06,24.12 180 top
R21  23.43,23.46 90 top
R22  79.01,37.48 270 top
R23  24.58,16.7 0 top
R24  75.71,37.35 270 top
R25  79.39,52.34 180 top
R26  63.26,47.13 270 top
R27  68.34,37.66 0 top
R28  66.56,52.09 270 top
R99  19.19,35.83 180 top
RES  19.93,40.3 180 top
RX1  17.08,9.01 0 top
SV2  44.72,5.35 180 top
SV3  4.33,43.83 90 top
T3  19.83,31.51 90 top
TX1  19.12,8.98 0 top
U1  50.56,30.62 180 top
U2  69.23,44.72 0 top
U3  16.91,46.12 0 top
U4  77.1,44.85 0 top
U5  74.18,13.22 180 top
Y1  47.77,46.5 90 top
Y2  32.83,36.26 90 top
Y4  9.82,12.92 0 top
Z3  7.33,24.22 0 top
Z4  7.99,18.74 180 top

### Tracks (layer width: path | path; a pad name or v marks a point on that pad's centre or on a via)
16U2-TX
  Top 0.254: IC6.9 16.7,12.26 15.93,11.49 IC10.1
  Top 0.406: IC10.2 IC10.1
+3V3  (via drill 0.6)
  Top 0.254: 39.77,11.95 40.28,11.45 48.15,11.45 48.86,12.16 L1.1 | 53.55,38.81 53.55,39.86 54.32,40.63 54.32,41.41 U1.11 54.32,41.43 54.32,43.02 | U1.125 61.37,29.86 62.5,29.86 64.15,31.51 65.61,31.51 | v41.65,31.87 U1.52 37.02,31.87 35.86,33.04 35.83,33.04 | 45.23,26.86 U1.62 38.42,26.86 37.09,25.53 C6.2 | 58.51,21.23 58.44,21.23 57.83,20.61 57.83,19.84 U1.105 57.83,19.81 57.83,17.77 58.61,16.98 | U1.57 37.62,29.37 v37.23,28.97
  Top 0.305: v33.37,33.14 34.78,33.14 R4.2 35.51,33.04 35.83,33.04 | C6.2 C4.2 C18.2 37.34,16.45 C1.2 37.86,13.46 v37.86,11.95 | C8.2 65.61,31.51 65.61,31.19 v66.44,30.88 | 58.51,21.23 64.28,21.23 | 64.28,21.23 65.57,21.23 66.35,22 C29.2 | C7.2 62.37,13.52 | 63.52,10.68 IC4.2 | IC10.5 15.13,9.27 15.13,8.65 15,8.53 13.15,8.53 12.89,8.78 | 54.32,43.02 55.52,44.21 C5.2 | 53.55,38.81 v46.62,31.89 46.62,28.26 45.23,26.86 | 58.61,16.98 v60.49,16.98 | L1.1 49.04,12.25 49.04,9.79 49.24,9.59 JR1.1 51.47,8.51 51.96,8.02 55,8.02 BR1.3 57.29,8.91 59.6,11.22 59.6,12.82 v60.49,13.71 | 39.77,11.95 v37.86,11.95 | SV3.4 14.88,35.83 16.14,35.83 | 16.14,35.83 R99.2 18.3,35.87 18.3,37.48 19.32,38.5 v21.22,38.5 22.37,37.35 ERASE.1 | T3.1 16.14,33.24 16.14,35.83 | C37.1 36.66,11.95 v37.86,11.95 | v66.44,27.07 65.29,25.92 65.29,22.24 64.28,21.23
  Top 0.406: 12.89,8.78 12.39,9.67 v10.43,9.67
  Top 0.813: 63.52,10.68 62.18,12.02 C7.2 v60.49,13.71 | IC4.4 IC4.2
  Bottom 0.254: 24.31,35.8 24.3,35.81 22.55,35.81 | 21.22,37.12 v21.22,38.5
  Bottom 0.305: v33.37,33.14 33.34,33.16 L2.1 24.31,35.8 | v66.44,27.07 v66.44,30.88 | v46.62,31.89 41.67,31.89 v41.65,31.87 41.65,31.61 39.89,29.86 38.75,29.86 v37.23,28.97 | v60.49,16.98 v60.49,13.71 | 21.22,37.12 21.22,36.21 21.63,35.81 22.55,35.81
  Bottom 0.406: v10.43,9.67 10.43,5.1 11.83,3.7 21.86,3.7 24.53,6.37 34.94,6.37 37.86,9.29 v37.86,11.95
+5V  (via drill 0.6)
  Top 0.254: 16.71,19.14 v15.51,20.34 | IC6.4 15.98,16.83 15.54,16.83 15.13,16.42 15.13,14.62 14.41,13.9 C36.1 | v27.85,12.23 28.21,12.59 28.21,13.48 28.72,13.98
  Top 0.305: ICSP1.2 26.81,13.98 28.72,13.98 D2.C 30.22,14.72 30.21,15 | IC6.32 16.71,19.14 | R15.1 v11.57,7.23 | R13.2 30.21,15 | v61.23,7 61.23,9.95 IC4.3 60.52,9.29 58.94,9.29 57.04,7.38 51.58,7.38 50.05,8.91 48.4,8.91 47.64,9.67 v40.91,9.67 | v32.4,14.75 32.15,15 30.21,15 | R22.2 79.39,36.25 v79.39,34.69 79.39,34.2 C44.+ 73.52,31.39 71.73,29.59 R16.2 71.73,26.37 | U4.3 v77.74,43.96 | v70.17,43.5 70.17,43.25 69.84,42.92 69.84,41.57 U2.3 69.86,38.32 R27.2 | 14.41,13.9 v12.72,12.21
  Top 0.406: R15.1 13.24,7.18 R14.1
  Top 0.61: C30.2 67.2,16.56 v67.2,14.62 67.83,14.62 68.47,13.99 71.14,13.99 71.39,14.24 71.39,17.24 U5.4 | JR2.2 11,34.38 v11,34.61
  Bottom 0.254: 15.08,12.08 15.23,12.23 | 14.12,12.13 14.11,12.13 14.11,11.68
  Bottom 0.305: 15,20.34 v15.51,20.34 | v40.91,9.67 40.91,14.75 v32.4,14.75 | 79.26,34.56 v79.39,34.69 80.15,35.45 80.15,43.45 79.64,43.96 v77.74,43.96 70.63,43.96 v70.17,43.5 | v12.72,12.21 12.89,12.03 12.89,11.68
  Bottom 0.61: 14.12,21.22 11,24.34 v11,34.61 11,35.09 11,36.66 8.4,39.26 8.4,47.39 | 14.12,21.22 15,20.34 | 79.26,34.56 74.31,31.26 74.31,4.71 | SV3.5 5.86,47.39 8.4,47.39 | 8.4,47.39 U3.1 | 14.12,21.22 14.12,12.13 | 15.08,12.08 14.67,11.68 14.11,11.68 12.89,11.68 11.57,10.35 v11.57,7.23 | 15.23,12.23 v27.85,12.23 | +5.TP 45.08,52.62 9.82,52.62 8.4,51.2 8.4,47.39
  Bottom 0.813: v61.23,7 63.52,4.71 67.2,4.71 | 67.2,4.71 74.31,4.71 | v67.2,14.62 67.2,4.71
AD0  (via drill 0.6)
  Top 0.254: U1.78 44.31,21.38 v44.21,21.48
  Bottom 0.254: 42.43,16.14 43.73,17.44 44.24,17.44 44.59,17.8 44.59,19.19 44.21,19.57 v44.21,21.48
  Bottom 0.305: SV2.4 42.43,5.6 42.43,16.14
AD1  (via drill 0.6)
  Top 0.254: U1.79 44.82,19.81 44.82,18.84 45.48,18.18 v45.48,18.05
  Bottom 0.254: 43.07,15.76 44.21,16.91 45.23,16.91 45.48,17.16 v45.48,18.05
  Bottom 0.305: SV2.3 43.07,7 43.07,15.76
AD2  (via drill 0.6)
  Top 0.254: U1.80 45.3,20.72 45.69,21.1 v45.69,21.96
  Bottom 0.254: 43.7,15.51 44.59,16.4 45.99,16.4 46.37,16.78 46.37,17.29 | v45.69,21.96 46.37,21.28 46.37,18.81
  Bottom 0.305: SV2.2 45.61,7 44.09,7 43.7,7.38 43.7,15.51 | 46.37,17.29 46.37,18.81
AD3  (via drill 0.6)
  Top 0.254: U1.81 | U1.81 45.81,19.04 46.68,18.18 v47.39,18.18
  Bottom 0.254: 44.34,15.26 44.97,15.89 46.75,15.89 47.39,16.53 47.39,16.91
  Bottom 0.305: SV2.1 47.51,7.64 45.48,7.64 44.34,8.78 44.34,15.26 | 47.39,16.91 v47.39,18.18
AREF
  Top 0.305: BR1.1 56.47,12.08 57.17,12.08 57.93,12.84 AREF.TP
AVREF
  Top 0.254: U1.75 42.82,17.8 43.45,17.16
  Top 0.305: L3.2 55.56,16.46 C19.2 51.26,16.46 50.56,17.16 43.45,17.16
AVREFL
  Top 0.305: L3.1 54.23,12.31 C34.2 53.17,12.23 JR1.2 55.28,9.59 BR1.2
BD+
  Top 0.305: Z4.2 6.89,19.59 8.27,20.97 8.27,22.75 8.4,22.88 15.76,22.88 16.27,23.38 16.27,24.06 R20.2
  Top 0.406: Z4.2 6.31,19.32 J3.P3
BD-
  Top 0.305: J3.P2 6.39,19.98 7.38,20.97 7.38,23.64 7.97,24.22 Z3.2 | 8.4,24.19 Z3.2 | R19.2 8.51,24.3 Z3.2
  Top 0.406: J3.P2 4.38,19.95
CANRX0  (via drill 0.6)
  Top 0.254: U1.24 47.82,40.48 48.48,39.82 48.48,39.77
  Top 0.305: v77.87,39.64 79,40.39 U4.4 | 48.48,39.77 v49.55,39.77
  Bottom 0.305: v49.55,39.77 58.82,39.77 59.96,40.91 72.66,40.91 73.93,39.64 v77.87,39.64
CANTX0  (via drill 0.6)
  Top 0.254: U1.23 48.3,41.43 v48.3,43.75
  Top 0.305: v48.3,43.75 48.31,43.74 | v73.42,41.8 75.09,41.8 U4.1
  Bottom 0.305: v48.3,43.75 56.71,43.75 56.79,43.83 56.91,43.83 58.18,42.56 59.58,42.56 60.34,41.8 v73.42,41.8
CANTX1/IO  (via drill 0.6)
  Top 0.254: U1.140 61.38,37.35 62.75,37.35 64.41,39 v64.41,39.39
  Top 0.305: U2.1 67.33,40.15 68.09,39.39 v68.34,39.39
  Bottom 0.305: v64.41,39.39 v68.34,39.39
D+  (via drill 0.6)
  Top 0.254: v37.23,43.32 39.76,40.79 U1.37
  Top 0.305: U1.37
  Bottom 0.254: R6.1 v37.23,43.32
D-  (via drill 0.6)
  Top 0.254: U1.38 37.74,38.88 37.35,39.13 v36.77,39.13
  Bottom 0.254: R5.1 36.77,37.57 v36.77,39.13
DAC0(CANRX1)  (via drill 0.6)
  Top 0.254: U1.76 43.3,19.84 43.3,23.11 43.32,23.13
  Top 0.305: v71.11,38.98 71.11,41.55 U2.4 | 43.32,23.13 54.63,34.43 v56.91,34.43
  Bottom 0.305: v71.11,38.98 70.12,37.99 64.79,37.99 61.23,34.43 v56.91,34.43
DAC1  (via drill 0.6)
  Top 0.254: U1.77 43.83,19.8 43.81,19.78 43.81,19.04 43.7,18.94 v43.7,18.43
  Bottom 0.305: SV2.5 41.8,7.51 41.8,16.4 v43.7,18.43
DTR
  Top 0.305: IC6.13 18.71,13.05 21,10.76 21,10.46 21,10.45 R18.1
  Top 0.406: R18.1 20.84,9.73
ERASE_CMD  (via drill 0.6)
  Top 0.254: IC6.23 22.77,17.85
  Top 0.305: R99.1 19.83,35.61 19.83,33.54 18.81,32.53 T3.2 19.95,31.36 v19.95,29.35 | 22.77,17.85 26.03,21.1 v26.05,21.1
  Bottom 0.305: v19.95,29.35 26.05,23.26 v26.05,21.1
ERASE_S  (via drill 0.6)
  Top 0.254: U1.130 60.65,32.38 60.62,32.35 v60.06,32.35
  Top 0.305: ERASE.2 v23.89,31.77 22.62,31.77 22.37,31.51 20.87,31.51 T3.3
  Bottom 0.305: v23.89,31.77 25.29,30.37 25.29,26.81 26.18,25.92 49.29,25.92 55.74,32.35 v60.06,32.35
GND  (via drill 0.6)
  Top 0.254: 17.86,16.84 17.86,16.97 18.71,17.82 IC6.28 18.71,22.77 | IC6.3 15.99,17.34 14.75,17.34 14.28,16.87 13.93,16.53 C36.2 | 42.82,30.88 42.82,34.58 42.51,34.89 39.78,34.89 U1.46 38.88,34.86 38.55,35.19 38.55,35.5 38.92,35.87 U1.44 | 48.95,47.91 48.91,47.95 48.91,48.15 49.8,49.04 v53.51,52.7 | 64.79,33.8 64.28,33.8 63.9,33.42 63.9,32.15 62.12,30.37 U1.126 | C22.2 52.01,47.93 53.61,47.93 | 53.61,47.93 56.02,47.93 | U1.12 53.81,42.79 53.61,42.99 53.61,47.93 | U1.33 43.32,41.43 43.32,42.18 43.97,42.83 43.97,44.22 | 42.82,30.88 U1.54 | 35.64,26.38 35.96,26.05 36.21,26.05 39.03,28.87 U1.58 42.21,28.87 42.82,29.48 42.82,30.88 | 42.31,16.77 U1.74 42.31,20.59 41.8,21.1 40.91,21.1 | U1.106 58.31,18.94 59.02,18.23
  Top 0.305: IC6.3 17.35,17.35 17.86,16.84 18.1,16.6 IC6.33 18.71,16.85 | J3.P$1 5.17,21.94 6.11,22.88 6.11,24.1 Z3.1 | 18.71,22.77 19.32,23.38 19.32,24.15 20.53,24.15 C38.2 | IC10.3 13.27,11.49 12.84,11.06 11.9,11.06 Y4.2 12.08,13.11 12.08,14.95 11.95,15.08 v11.95,15.64 12.37,16.06 12.37,16.11 13.3,16.11 C36.2 | 35.39,21.48 C4.1 v35.39,18.33 C18.1 35.34,16.66 C1.1 34.94,13.99 31.89,10.94 31.89,8.88 C37.2 29.99,6.98 | 35.39,21.48 C6.1 35.58,23.04 35.58,25.81 C11.1 35.64,26.38 | 35.39,21.48 35.26,21.61 31.51,21.61 31.14,21.97 C15.1 C12.1 C14.1 29.23,29.48 27.46,31.24 R8.1 C23.2 C24.2 27.96,38.33 27.96,40.02 28.18,40.25 C9.1 C25.2 R7.1 27.12,45.84 26.18,46.78 | 43.96,45.06 C32.1 | C21.2 43.97,46.37 | 43.97,46.37 C32.1 | 43.97,46.37 43.84,46.5 41.55,46.5 40.02,48.02 39.62,48.02 C33.1 | 44.22,48.27 C21.2 | 44.25,48.3 C21.2 | C5.1 56.02,47.93 C13.1 58.87,47.98 R26.1 63.26,47.87 U2.8 67.33,45.86 68.59,44.6 U2.2 | C16.1 63.88,16.73 C7.1 | 59.02,18.23 63.52,18.23 63.83,17.91 C16.1 | 20.97,2.94 20.97,7.85 R18.2 22.63,7.88 23.26,7.25 24.27,7.25 25.49,8.47 ICSP1.6 | C32.1 46.57,45.08 Y1.4 48.69,47.2 Y1.2 48.95,47.91 C22.2 | 43.97,44.22 C32.1 | 40.91,21.1 39.89,20.08 | 39.89,20.08 39.89,14.24 40.41,13.72 C10.1 41.64,13.37 C3.1 | C19.1 51.39,14.5 C34.1 50.05,13.64 50.05,16.27 49.8,16.53 42.56,16.53 42.31,16.77 | U4.8 75.2,45.99 76.46,44.73 U4.2 76.46,38.96 R24.1 | SV3.1 SV3.2 1.54,44.08 1.54,50.82 2.3,51.58 20.21,51.58 | 64.79,33.8 66.56,33.8 67.31,33.05 C8.1 | C16.1 64.02,16.78 65.42,18.18 67.11,18.18 C30.1 68.05,18.39 68.47,18.81 68.47,22.61 C29.1 67.07,25.16 67.71,25.8 67.71,28.7 C17.1
  Top 0.305: 67.44,32.45 67.47,32.48 | C43.- 78.76,24.04 | 39.89,20.08 38.75,18.94 v38.75,18.43 | 20.21,51.58 23.77,51.58 26.18,49.17 26.18,46.78 | U3.7 19.45,50.69 20.21,51.45 20.21,51.58 | 26.18,46.78 C2.1 | C40.2 14.01,16.87 14.28,16.87
  Top 0.406: J3.S3 J3.P$2 4.11,21.68 | J3.S3 J3.P$1 4.11,21.68 | J3.P$4 3.06,21.68 | 3.06,21.68 3.19,21.68 | J3.P$8 3.47,15.81 2.81,15.81 | 2.81,15.81 J3.P$5 1.72,16.02 J3.S2 1.62,16.02 J3.P$6 | 3.06,21.68 3.01,21.68 J3.S5 J3.S6 2.81,17.16 2.81,15.81 | J3.P$4 3.23,24.13 C28.2 | J3.P5 J3.P$7 J3.S4 J3.P$8 | C39.2 6.51,16.7 J3.P$8 | 4.11,21.68 3.19,21.68 | 3.19,21.68 3.32,21.81 J3.S3 | J3.P$4 2.33,23.23 2.38,23.23 1.97,22.82 J3.P$3 1.62,22.62 J3.S1 | 9.06,18.74 Z4.1 | Z4.1 7.77,17.41 7.26,17.41 6.99,17.15 C39.2 | Z4.1 9.16,18.8 v9.16,20.21 | Y4.4 6.99,15.53 C39.2 | C8.1 67.44,32.45 C17.1 | C7.1 65.83,11.76 IC4.1 | R17.1 73.42,24.18 73.42,26.56 74.56,27.7 78.76,27.7 | 29.99,6.98 29.99,2.94
  Top 0.61: C44.- 78.65,31.26
  Top 0.813: v57.29,2.94 29.99,2.94 20.97,2.94 10.05,2.94 5.22,7.76 5.22,14.11 3.52,15.81 J3.P$5 | v78.76,22.11 78.76,24.04 78.76,27.7 78.76,31.15 78.65,31.26
  Top 1.016: U5.3 73.03,17.26 U5.6 73.03,6.87 72.91,6.75 | GND.TP v78.63,6.75 72.91,6.75 | IC4.1 65.83,6.75 72.91,6.75
  Top 1.422: 73.17,9.79 72.02,9.79 72.41,9.41 72.41,8.91 73.03,8.28 U5.6
  Bottom 0.305: v38.75,18.43 38.65,18.33 v35.39,18.33
  Bottom 0.406: v9.16,20.21 9.67,20.72 11.32,20.46 12.21,19.57 v11.95,15.64
  Bottom 0.813: v78.76,22.11 78.63,21.99 v78.63,6.75
  Bottom 1.016: v57.29,2.94 76.72,2.94 78.63,5.1 v78.63,6.75
  other vias: 5.12,52.95 11.4,50.18 21.43,53.84 36.24,53.79 7.89,35.32 12.97,34.05 3.5,11.19 2.99,6.92 6.54,3.57 32.53,3.67 51.07,22.62 56.15,26.43 80.28,17.54 29.25,49.72
  pour Top (isolate 0.61): 0.4,55.13 83.2,55.13 83.2,1.41 0.27,1.41 0.27,1.54 0.27,55.39
  pour Bottom (isolate 0.61): 0.27,55.26 83.07,55.26 83.07,1.54 0.14,1.54 0.14,1.67 0.14,55.52
MASTER-RESET  (via drill 0.6)
  Top 0.254: U1.47 40.61,34.38 41.55,33.44 v41.72,33.44
  Top 0.305: R23.2 28.97,20.25 v28.97,27.96 28.16,27.96 25.87,30.24 25.87,38.09 24.32,39.64 24.32,40 | U3.9 24.32,45.05 24.32,40 | RES.TP 20.44,40.81 23.31,40.81 24.12,40 24.32,40
  Bottom 0.305: v28.97,27.96 31.51,30.5 38.75,30.5 41.7,33.44 v41.72,33.44
MISO2
  Top 0.305: IC6.17 21.35,14.85 22.65,13.55 ICSP1.1
MOSI2
  Top 0.305: IC6.16 20.8,14.15 22.75,12.21 26.18,12.21 26.3,12.08 26.3,11.09 ICSP1.4
N$1
  Top 0.254: IC6.26 19.7,19.57 22.74,22.61 R21.1
N$4
  Top 0.406: R15.2 15.62,7.96 RX1.A
N$5  (via drill 0.6)
  Top 0.254: U1.51 38.78,32.38 38.42,32.73 37.63,32.73 37.2,33.16 v36.97,33.16
  Top 0.305: R8.2 32.6,32.2 v33.16,31.64
  Bottom 0.305: v33.16,31.64 35.96,31.64 v36.97,33.16
N$7
  Top 0.254: U1.53 39.75,31.39 38.88,31.39 38.5,31 36.47,31 36.1,31.37 35.48,31.37
  Top 0.305: 35.48,31.37 R4.1
N$11  (via drill 0.6)
  Top 0.305: v37.68,36.24 38.14,36.24 38.28,36.37 U1.43
  Bottom 0.254: R5.2 35.46,34.56 37.1,34.56 37.68,35.14 v37.68,36.24
N$12  (via drill 0.6)
  Top 0.254: U1.42 41.14,36.87 41.55,37.28 v41.55,37.86
  Bottom 0.254: R6.2 39.51,41.15 39.51,40.28 41.55,38.24 v41.55,37.86
N$13
  Top 1.016: C43.+ 76.47,22.73 76.47,16.65 76.47,16.14 +12.TP
  Top 1.422: 76.47,16.65 U5.1 U5.2
N$14
  Top 0.406: R14.2 16.61,6.62 18.05,6.62 19.12,7.69 TX1.A
N$15
  Top 0.406: R16.1 R17.2 69.66,22.13 U5.5
N$16  (via drill 0.6)
  Top 0.305: R27.1 65.55,40.19 65.55,44.21 | 65.55,44.21 65.55,45.74 65,46.28 R26.2 | U2.5 v71.14,45.86 | v67.2,44.21 65.55,44.21
  Bottom 0.305: v71.14,45.86 69.48,44.21 v67.2,44.21
N$17
  Top 0.305: U4.5 79.01,46.62 80.41,45.23 80.41,39.73 R22.1 77.95,38.33 77.49,37.86 77.49,36.85 76.98,36.34 75.87,36.34 R24.2
N$18
  Top 0.305: CH0.TP 72.53,50.56 75.2,50.56 75.45,50.56 | 75.45,50.56 76.47,49.55 U4.7 | R25.2 76.76,50.56 75.45,50.56
N$19
  Top 0.305: CL0.TP 76.47,53.99 80.03,53.99 80.24,53.78 R25.1 80.24,50.65 80.15,50.56 78.5,50.56 77.74,49.8 U4.6
N$21
  Top 0.305: CH1.TP 60.09,50.31 64.41,50.31 65.33,51.24 R28.2 66.65,51.24 68.6,49.29 U2.7
N$22
  Top 0.305: CL1.TP 62.84,52.94 R28.1 66.98,52.94 69.87,50.05 U2.6
N$27  (via drill 0.6)
  other vias: 32.02,20.08
N$32  (via drill 0.6)
  other vias: 72.66,35.32
N$33  (via drill 0.6)
  other vias: 65.04,35.32
N$34  (via drill 0.6)
  other vias: 62.55,19.45
N$36  (via drill 0.6)
  other vias: 61.23,44.21
RD+
  Top 0.254: IC6.29 18.23,19.07 18.23,22.19 17.91,22.51 R20.1
RD-  (via drill 0.6)
  Top 0.254: IC6.30 17.72,19.07 17.72,20.26 16.78,21.2 16.78,21.61
  Top 0.305: R19.1 14.34,24.3 v14.37,24.27 | v16.78,22.11 16.78,21.61
  Bottom 0.305: v14.37,24.27 15.89,24.27 16.78,23.38 v16.78,22.11
RESET2  (via drill 0.6)
  Top 0.254: IC6.24 21.62,19.07 v22.37,19.07
  Top 0.305: ICSP1.5 25.16,9.79 28.21,9.79 | 28.21,9.79 29,10.58 D2.A | 28.21,9.79 28.34,9.79 v28.97,9.16 | R13.1 v27.04,16.65
  Bottom 0.305: v28.97,9.16 28.97,12.46 27.43,14.89 | 27.43,14.89 26.56,14.88 23.38,14.88 22.37,15.89 v22.37,19.07 | v27.04,16.65 27.43,14.89
RESET_CMD
  Top 0.254: IC6.22 20.92,17.34 21.84,17.34 22.47,16.7 R23.1
RX  (via drill 0.6)
  Top 0.254: U1.27 46.32,37.18
  Top 0.305: IC10.4 13.58,10.56 v7.51,10.56 | v7.13,27.7 15.38,27.7 | 15.38,27.7 v26.81,27.7 | 46.32,37.18 47.77,35.73 v47.77,35.58 | v15.26,30.37 15.38,30.24 15.38,27.7
  Bottom 0.305: v7.51,10.56 7.13,10.94 v7.13,27.7 | v26.81,27.7 27.7,26.81 46.75,26.81 47.77,27.83 v47.77,35.58 | 15.26,43.32 15.26,42.81
  Bottom 0.406: v15.26,30.37 15.26,42.81 15.26,43.37 15.66,43.78 15.66,46.09 U3.3
RXL-U2
  Top 0.254: IC6.10 17.21,11.65 17.09,11.52 RX1.C
SCK2
  Top 0.254: IC6.15 19.7,13.43 19.9,13.22 20.21,13.22
  Top 0.305: ICSP1.3 23.54,11.32 22.37,11.32 20.46,13.22 20.21,13.22
SS0/PWM10
  Top 0.254: U1.111 60.6,22.88 60.21,23.26 58.11,23.26 56.3,21.45 56.3,19.86 56.33,19.84 U1.102
SS1/PWM4  (via drill 0.6)
  Top 0.254: U1.112 61.37,23.38 v63.85,23.38 | U1.137 60.42,35.88 59.15,34.61 59.15,34.56
  Top 0.305: 59.15,34.56 v59.15,30.6 | v63.85,23.38 63.84,23.37
  Bottom 0.305: v59.15,30.6 63.85,25.9 v63.85,23.38
TX  (via drill 0.6)
  Top 0.254: U1.2 v58.82,43.45
  Top 0.305: IC6.8 15.64,14.48 v15.64,13.61
  Bottom 0.305: v58.82,43.45 57.29,44.97 57.32,49.17 54.73,50.66 33.14,50.66 27.19,43.45 20.84,43.45 | 17.8,38.32 17.8,38.5 | 18.15,46.14 18.18,46.12 18.18,40.78
  Bottom 0.406: v15.64,13.61 15.64,18.81 17.8,20.97 17.8,38.32 17.8,40.4 18.18,40.78 20.84,43.45 | U3.5 18.15,46.14
TXL-U2
  Top 0.254: IC6.11 17.72,14.14 17.72,13.45 17.92,13.25 17.92,11.23
  Top 0.305: 17.92,11.23 TX1.C
USBVCCU2  (via drill 0.6)
  Top 0.254: IC6.31 17.21,19.7 16.4,20.51 16.4,20.84 15.26,21.99 v15.13,21.99
  Top 0.305: C28.1 12.31,26.41 v12.33,26.43
  Top 0.406: C28.1 4.33,27 4.33,28.08 3.72,28.69 F2.1
  Top 0.61: JR2.1 8.01,29.69 F2.1
  Bottom 0.305: v12.33,26.43 12.84,26.43 13.22,26.05 13.22,23.89 v15.13,21.99
VBG
  Top 0.254: C25.1 35.45,40.31 35.45,38.5 36.2,37.87 U1.40
  Top 0.305: R7.2 C25.1
VDDANA
  Top 0.305: U1.73 41.29,19.3 C10.2 41.64,15.77 42.05,15.37 C3.2 46.22,14.63 L1.2
VDDOUT  (via drill 0.6)
  Top 0.254: 55.55,38.97 55.55,39.93 54.8,40.68 U1.10 54.83,41.44 54.83,42.23 56.05,43.45 57.04,43.45 58.82,45.23 C13.2 | 58.67,22.09 58,22.09 57.32,21.4 U1.104 57.29,19.79 57.32,19.77 57.32,18.94 56.94,18.56 56.94,17.14 58.46,15.61 61.99,15.61 | C17.2 62.88,28.97 62.5,29.35 61.38,29.35 U1.124 61.34,29.35 59.07,29.35 | v41.77,29.99 41.04,29.99 40.91,29.86 39.77,29.86 U1.56 38.88,29.86 38.75,29.99 35.58,29.99 35.07,29.48 35.07,28.32 | 44.16,34.48 44.16,28.67 v44.14,28.64 43.45,28.64 42.18,27.37 U1.61 | 44.16,34.48 v44.16,36.01 | U1.45 | U1.45 43.27,35.37 44.16,34.48 | 58.31,30.11 59.07,29.35 | v59.88,24.17 59.07,24.98 59.07,29.35
  Top 0.305: C15.2 32.91,23.83 32.91,26.69 32.88,26.71 C12.2 C14.2 35.07,29.48 | 55.55,38.97 v57.04,37.48 58.31,36.21 58.31,30.11 | 58.67,22.09 v59.88,22.09 | 61.99,15.61 62.13,15.75 C16.2 | 58.35,46.23 C13.2 | L5.1 35.58,45.6 v35.58,43.96 | C11.2 35.07,28.32
  Bottom 0.254: 35.58,41.67 35.58,40.4 37.35,40.4 40.78,36.59 44.16,36.59 | v41.77,29.99 43.12,28.64 v44.14,28.64 | 56.15,36.59 44.16,36.59 | v44.16,36.01 44.16,36.59
  Bottom 0.305: v59.88,24.17 v59.88,22.09 | v35.58,43.96 35.58,41.67 | 56.15,36.59 56.53,36.97 | 56.53,36.97 v57.04,37.48 | 56.53,36.95 56.53,36.97
VDDOUTMI  (via drill 0.6)
  Top 0.254: U1.41 39.74,37.35 35.7,37.35 33.8,39.26 32.91,39.26
  Top 0.305: C9.2 32.91,40.19 32.91,39.26 32.15,39.26 30.88,37.99 v30.75,37.99 | C2.2 27.46,41.42 28.97,41.42 29.23,41.67 v29.23,42.18
  Bottom 0.305: v29.23,42.18 30.75,40.66 v30.75,37.99 30.75,36.52 L2.2
VDDPLL
  Top 0.254: 42.82,43.6 U1.34
  Top 0.305: 42.31,45.04 C32.2 | L5.2 38.4,45.08 38.75,45.08 | 42.82,43.6 42.27,44.15 C32.2 | 38.75,45.08 C32.2 | C33.2 38.75,46.89 38.75,45.08
VUCAP
  Top 0.254: IC6.27 19.19,19.07 19.19,19.95 20.59,21.35 C38.1
XIN  (via drill 0.6)
  Top 0.254: 41.82,43.12 41.82,41.44 U1.36
  Top 0.305: C22.1 51.13,45.35 v50.05,45.35 Y1.1 | 41.82,43.12 41.55,43.4 v41.55,43.58
  Bottom 0.305: v41.55,43.58 41.55,45.36 41.55,45.35 v50.05,45.35
XIN32
  Top 0.254: U1.48 38.78,33.87 37.08,35.58 36.21,35.58 34.05,37.73
  Top 0.305: C24.1 29.16,37.04 29.48,36.72 31.13,36.72 32.15,37.73 32.76,37.73 Y2.P$2 32.91,37.73 34.05,37.73
XOUT  (via drill 0.6)
  Top 0.254: U1.35 42.31,40.28 42.05,40.02 v42.05,39.51
  Top 0.305: 41.92,48.37 C21.1 42.31,48.06 v42.31,49.67 44.82,49.67 Y1.3
  Bottom 0.305: v42.05,39.51 40.66,40.91 40.66,48.66 41.67,49.67 v42.31,49.67
XOUT32
  Top 0.254: U1.49 38.47,33.37 36.9,34.94 33.44,34.94
  Top 0.305: 33.44,34.94 Y2.P$1 31.79,34.71 31.26,34.18 30.13,34.18 C23.1
XT1
  Top 0.305: IC6.1 16.01,18.44 14.37,20.08 13.36,20.08 R9.1 | 8.7,16.22 9.79,15.13 9.79,12.59 9.2,11.99 Y4.1
  Top 0.406: R9.1 13.06,20.88 12.21,21.73 10.56,21.73 10.18,21.35 10.18,17.71 C39.1 8.7,16.22
XT2
  Top 0.254: IC6.2 15.51,17.85 14.29,19.07 11.74,19.07
  Top 0.305: R9.2 11.36,19.45 | 11.36,19.45 11.36,17.87 C40.1 | 11.74,19.07 11.36,19.45
  Top 0.406: C40.1 11.33,17.56 10.81,17.03 10.81,14 Y4.3
XVCC  (via drill 0.6)
  Top 0.406: F2.2 4.84,32.47 v4.84,31.89 | v5.86,20.97 5.53,20.64 J3.P1
  Bottom 0.406: v4.84,31.89 4.84,23.77 5.86,22.75 v5.86,20.97

### Text on the board
tPlace: + | + | + | + | +
bPlace: Digital Dash Rev.1, 03/28/2015 / J.Rodriguez, N.Erickson / R.Dass, S.Koppenhafer, C.Thueson
tNames: +5V | TX | RX | GND | RES | +5V | +3V3 | NC | GND | GND | + | +
ReferenceLC: PC2 | PC1